# EAGLE design SMC_FrontPanel_ExtensionBoardV8_SMD (EAGLE 9.6.2)
SIZE: 0.04
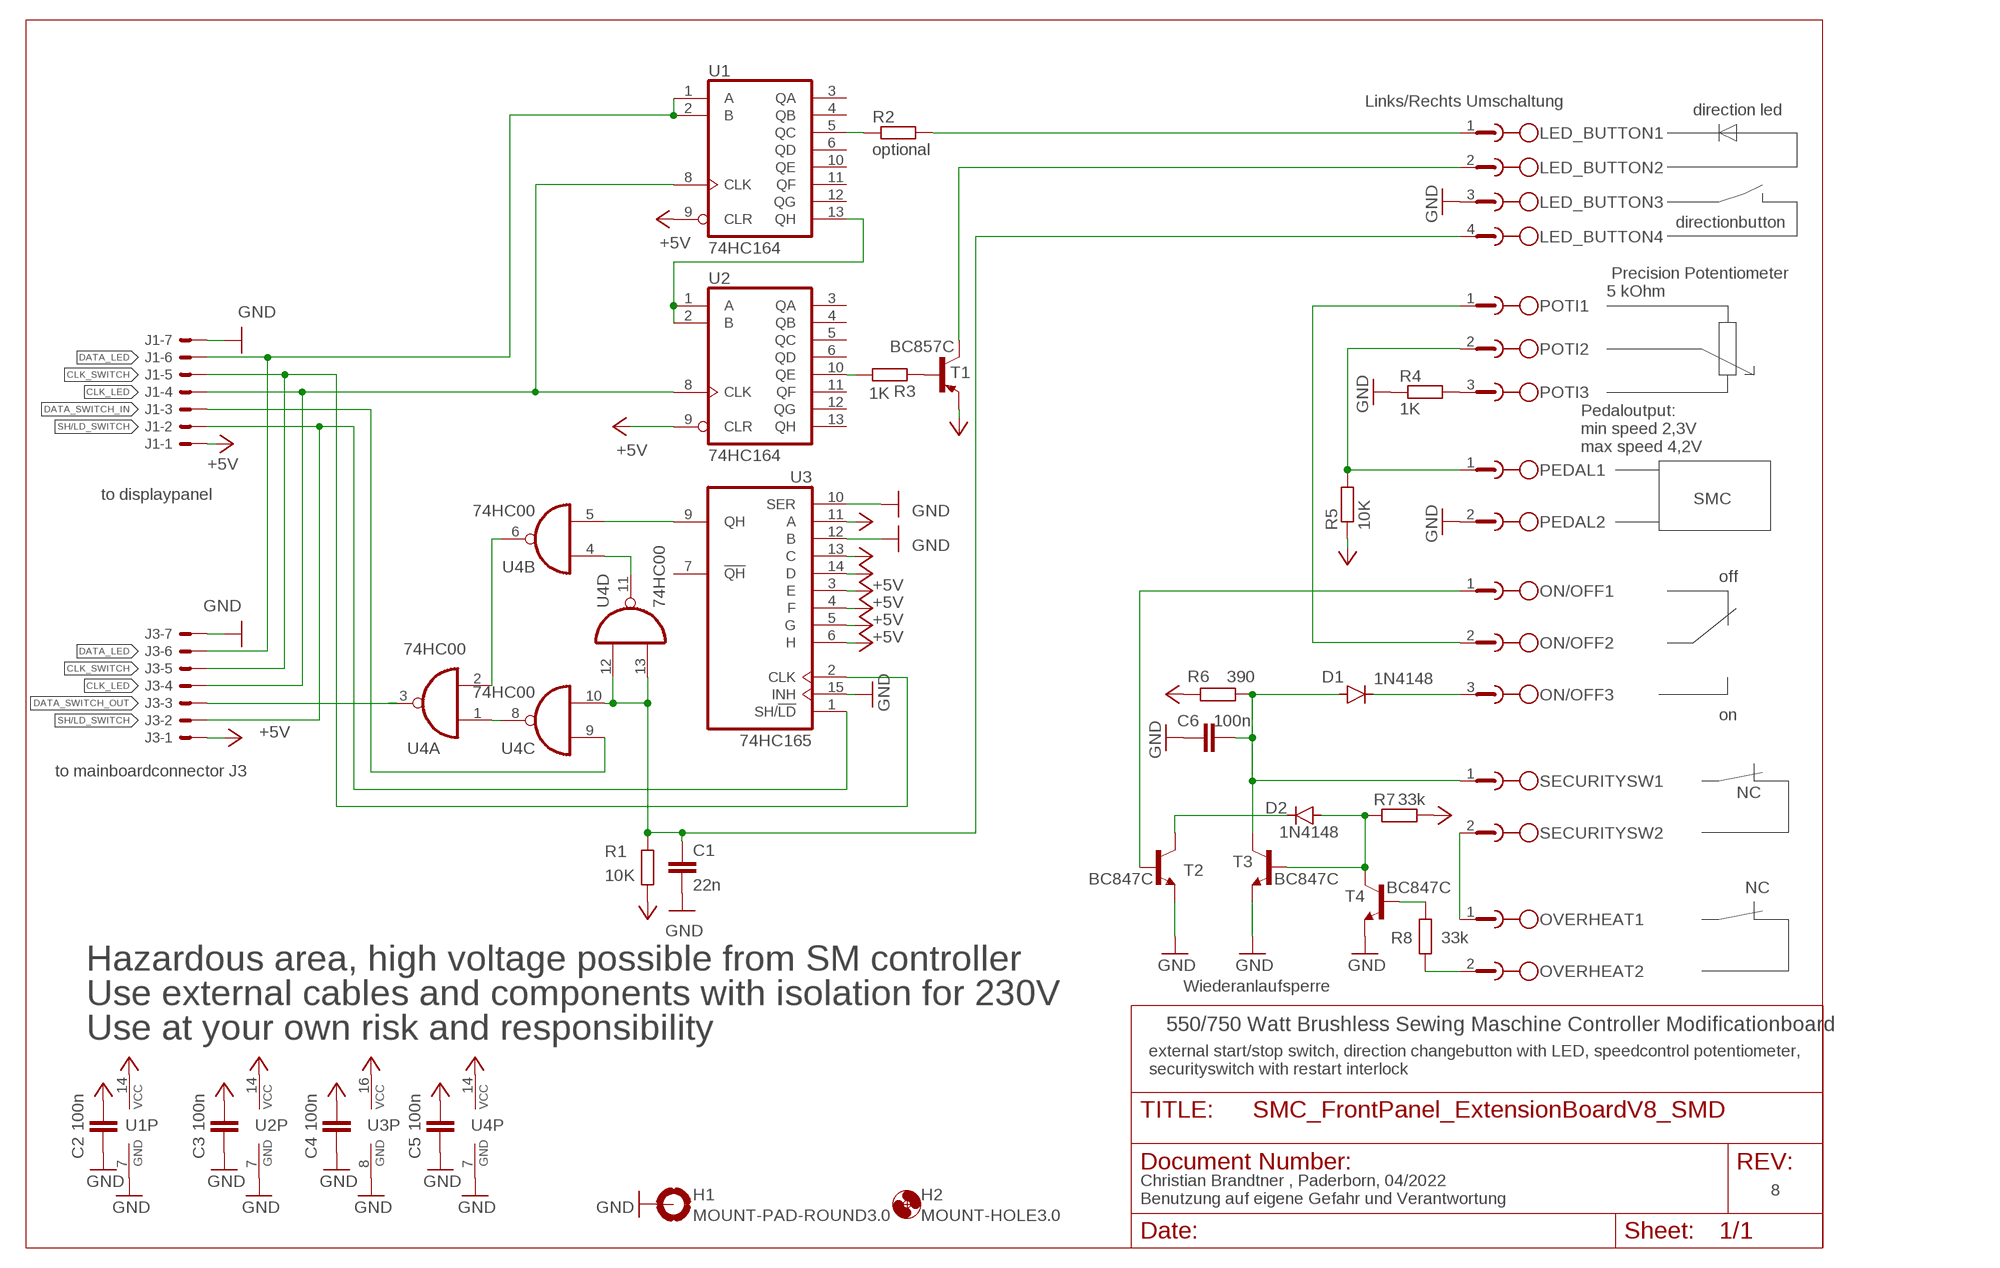
[diagram p0: schematic, sheet 1]

## Parts
C1  22n  C-EUC0805  [C0805]
C2  100n  C-EUC0805  [C0805]
C3  100n  C-EUC0805  [C0805]
C4  100n  C-EUC0805  [C0805]
C5  100n  C-EUC0805  [C0805]
C6  100n  C-EUC0805  [C0805]
D1  1N4148  DIODE-SOD323-W  [SOD323-W]
D2  1N4148  DIODE-SOD323-W  [SOD323-W]
H1  MOUNT-PAD-ROUND3.0  [3,0-PAD]
H2  MOUNT-HOLE3.0  [3,0]
J1  to displaypanel  JST-XH-07-PIN-ROUND-PAD  [JST-XH-07-PACKAGE-ROUND-PAD]
J3  to mainboardconnector J3  JST-XH-07-PIN-ROUND-PAD  [JST-XH-07-PACKAGE-ROUND-PAD]
LED_BUTTON  MC_1.5/4_G_3.5  [MC_1.5/4-G-3.5]
ON/OFF  MC_1.5/3-G-3.5  [MC_1.5/3-G-3.5]
OVERHEAT  MC_1.5/2-G-3.5  [MC_1.5/2-G-3.5]
PEDAL  MC_1.5/2-G-3.5  [MC_1.5/2-G-3.5]
POTI  MC_1.5/3-G-3.5  [MC_1.5/3-G-3.5]
R1  10K  R-EU_R0805  [R0805]
R2  optional  R-EU_R0805  [R0805]
R3  1K  R-EU_R0805  [R0805]
R4  1K  R-EU_R0805  [R0805]
R5  10K  R-EU_R0805  [R0805]
R6  390  R-EU_R0805  [R0805]
R7  33k  R-EU_R0805  [R0805]
R8  33k  R-EU_R0805  [R0805]
SECURITYSW  MC_1.5/2-G-3.5  [MC_1.5/2-G-3.5]
T1  BC857C  BC857C-PNP-SOT23-BEC  [SOT23-BEC]
T2  BC847C  BC847C-NPN-SOT23-BEC  [SOT23-BEC]
T3  BC847C  BC847C-NPN-SOT23-BEC  [SOT23-BEC]
T4  BC847C  BC847C-NPN-SOT23-BEC  [SOT23-BEC]
U1  74HC164  74HC164D  [SO14]
U2  74HC164  74HC164D  [SO14]
U3  74HC165  74HC165D  [SO16]
U4  74HC00  74HC00D  [SO14]

## Nets
+5V: C2.2 C3.2 C4.2 C5.2 J1.1 J3.1 R1.2 R5.1 R6.2 R7.1 T1.E U1.9(CLR) U1.14(VCC) U2.9(CLR) U2.14(VCC) U3.3(E) U3.4(F) U3.5(G) U3.6(H) U3.11(A) U3.13(C) U3.14(D) U3.16(VCC) U4.14(P:VCC)
CLK_LED: J1.4 J3.4 U1.8(CLK) U2.8(CLK)
CLK_SWITCH: J1.5 J3.5 U3.2(CLK)
DATA_LED: J1.6 J3.6 U1.1(A) U1.2(B)
DATA_SWITCH_IN: J1.3 U4.9(C:I0)
DATA_SWITCH_OUT: J3.3 U4.3(A:O)
G: U1.13(QH) U2.1(A) U2.2(B)
GND: C1.2 C2.1 C3.1 C4.1 C5.1 C6.1 H1.B3,0(MOUNT) J1.7 J3.7 LED_BUTTON.3 PEDAL.2 R4.1 T2.E T3.E T4.E U1.7(GND) U2.7(GND) U3.8(GND) U3.10(SER) U3.12(B) U3.15(INH) U4.7(P:GND)
N$1: R3.1 T1.B
N$2: LED_BUTTON.1 R2.2
N$3: R2.1 U1.5(QC)
N$4: LED_BUTTON.2 T1.C
N$5: ON/OFF.2 POTI.1
N$6: POTI.3 R4.2
N$7: PEDAL.1 POTI.2 R5.2
N$8: R8.1 T4.B
N$9: U3.9(QH) U4.5(B:I1)
N$10: U4.2(A:I1) U4.6(B:O)
N$11: OVERHEAT.2 R8.2
N$12: U4.1(A:I0) U4.8(C:O)
N$13: U4.4(B:I0) U4.11(D:O)
N$14: C1.1 LED_BUTTON.4 R1.1 U4.10(C:I1) U4.12(D:I0) U4.13(D:I1)
N$16: ON/OFF.1 T2.B
N$17: D1.C ON/OFF.3
N$18: C6.2 D1.A R6.1 SECURITYSW.1 T3.C
N$19: D2.C T2.C
N$20: OVERHEAT.1 SECURITYSW.2
N$23: D2.A R7.2 T3.B T4.C
N$27: R3.2 U2.10(QE)
SH/LD_SWITCH: J1.2 J3.2 U3.1(SH/!LD)
Unconnected: U1.3(QA) U1.4(QB) U1.6(QD) U1.10(QE) U1.11(QF) U1.12(QG) U2.3(QA) U2.4(QB) U2.5(QC) U2.6(QD) U2.11(QF) U2.12(QG) U2.13(QH) U3.7(!QH)

## Notes on the sheet
- Links/Rechts Umschaltung
- direction led
- directionbutton
- Precision Potentiometer
  5 kOhm
- Pedaloutput:
  min speed 2,3V
  max speed 4,2V
- SMC
- off
- on
- NC
- NC
- Hazardous area, high voltage possible from SM controller
- Wiederanlaufsperre
- Use external cables and components with isolation for 230V
- 550/750 Watt Brushless Sewing Maschine Controller Modificationboard
- Use at your own risk and responsibility
- external start/stop switch, direction changebutton with LED, speedcontrol potentiometer,
  securityswitch with restart interlock
- 8
- Christian Brandtner , Paderborn, 04/2022
  Benutzung auf eigene Gefahr und Verantwortung

## Library data of the parts
C1-C6 = rcl:C-EU: CAPACITOR, European symbol; SPICEPREFIX: C
D1 D2 = diode:DIODE-: DIODE
H1 = holes:MOUNT-PAD-ROUND: MOUNTING PAD, round
H2 = holes:MOUNT-HOLE: MOUNTING HOLE with drill center marker
J1 J3 = Rembrandt Electronics - JST XH Connectors v1-0:JST-XH-07-PIN: JST XH Connector 2 Pin Wire to board connector. Pitch: 2,54 mm, (0.100") Number of pins: 7 Created by Rembrandt Electronics www.rembrandtelectronics.com
LED_BUTTON = con-phoenix-350_CB:MC_1.5/4_G_3.5
ON/OFF POTI = con-phoenix-350_CB:MC_1.5/3-G-3.5
OVERHEAT PEDAL SECURITYSW = con-phoenix-350_CB:MC_1.5/2-G-3.5
R1-R8 = resistor:R-EU_: RESISTOR, European symbol
T1 = transistor:*-PNP-: PNP Transistror
T2-T4 = transistor:*-NPN-: NPN Transistror BF959 corrected 2008.03.06
U1 U2 = 74xx-eu:74*164: 8-bit parallel out SHIFT REGISTER
U3 = 74xx-eu:74*165: 8-bit parallel load SHIFT REGISTER
U4 = 74xx-eu:74*00: Quad 2-input NAND gate

## Board
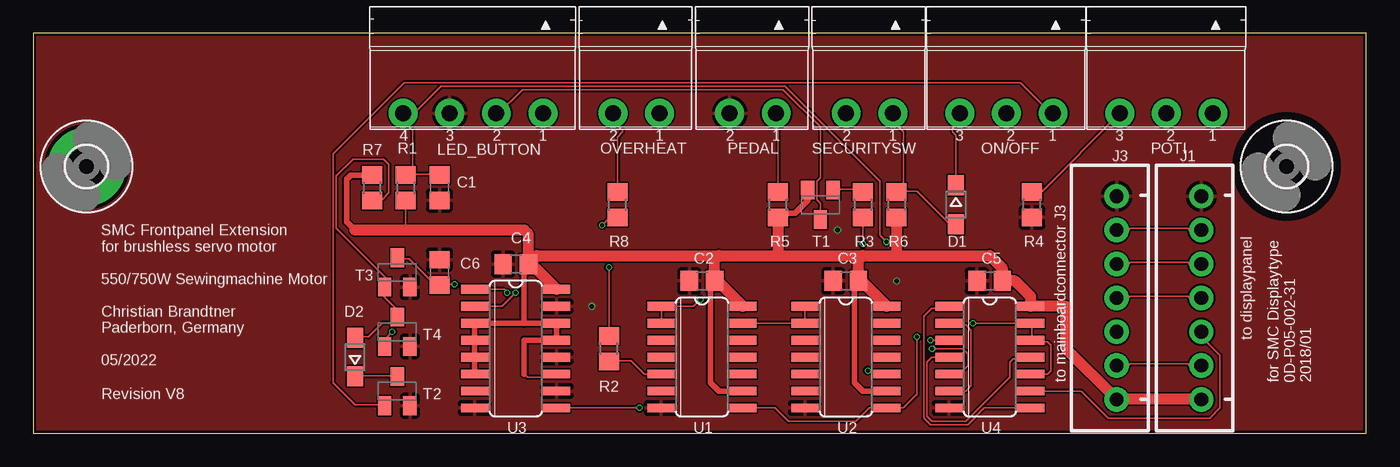
[diagram p1: board, top side]
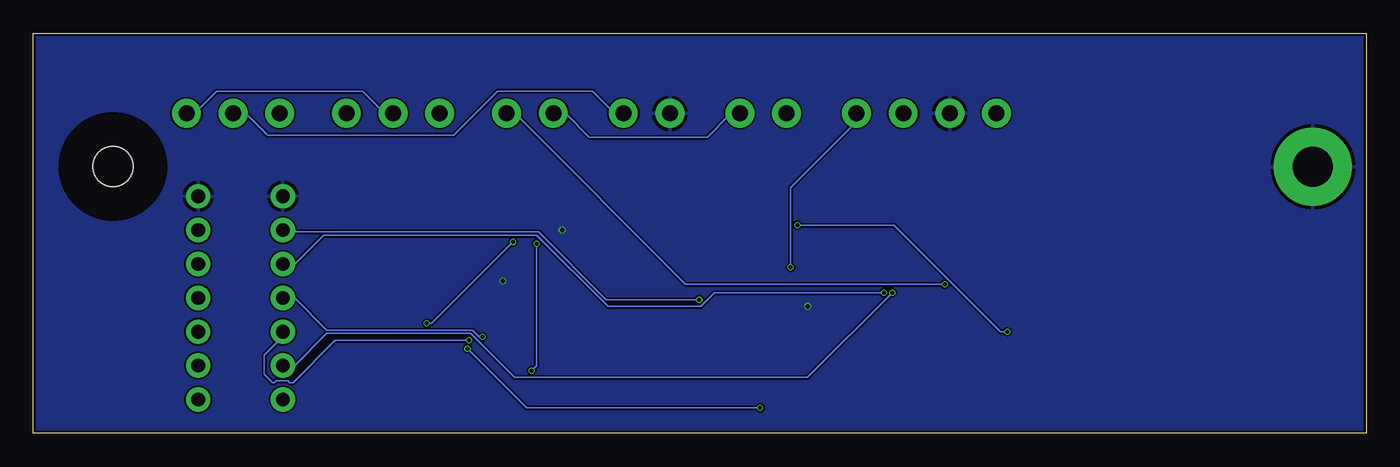
[diagram p2: board, bottom side, seen from below]

Size 100 x 30 mm. Coordinates in mm from the lower left corner, seen from the top.
Outline: 0,0 100,0 100,30 0,30 0,0
Copper layers (1*16): Top 0.035mm / dielectric 1.6mm / Bottom 0.035mm
Design rules "jlcpcb-2layers": minimum track width 5mil, minimum drill 0.3mm, track to track 5mil, track to pad 5mil, pad to pad 5mil, via to via 5mil, smd to smd 5mil, copper to edge 0.2mm, drill to drill 6mil, minimum pad ring 10mil, minimum via ring 3mil, stop-mask expansion 4mil, vias tented up to drill 0mil, thermal gap 10mil

### Footprints (pad centres in the part's own frame; a part is rotated, then mirrored left to right if it is on the bottom)
C0805 = smd 1.3 x 1.5: 1 -0.95,0; 2 0.95,0
SOD323-W = smd 1.5 x 1.2: A 1.45,0; C -1.45,0
3,0-PAD = drill 3 pad 5.842: B3,0 0,0
3,0 = hole 3: 0,0
JST-XH-07-PACKAGE-ROUND-PAD = drill 1.016: 1 -7.62,0; 2 -5.08,0; 3 -2.54,0; 4 0,0; 5 2.54,0; 6 5.08,0; 7 7.62,0
MC_1.5/4-G-3.5 = drill 1.2 pad 2: 1 0.013,0; 2 3.513,0; 3 7.013,0; 4 10.513,0
MC_1.5/3-G-3.5 = drill 1.2 pad 2: 1 -3.511,0; 2 -0.011,0; 3 3.489,0
MC_1.5/2-G-3.5 = drill 1.2 pad 2: 1 0.013,0; 2 3.513,0
R0805 = smd 1.3 x 1.5: 1 -0.95,0; 2 0.95,0
SOT23-BEC = smd 1 x 1.4: B -0.95,-1.1; C 0,1.1; E 0.95,-1.1
SO14 = smd 0.66 x 2.032: 1 -3.81,-3.073; 2 -2.54,-3.073; 3 -1.27,-3.073; 4 0,-3.073; 5 1.27,-3.073; 6 2.54,-3.073; 7 3.81,-3.073; 8 3.81,3.073; 9 2.54,3.073; 10 1.27,3.073; 11 0,3.073; 12 -1.27,3.073; 13 -2.54,3.073; 14 -3.81,3.073
SO16 = smd 0.66 x 2.032: 1 -4.445,-3.073; 2 -3.175,-3.073; 3 -1.905,-3.073; 4 -0.635,-3.073; 5 0.635,-3.073; 6 1.905,-3.073; 7 3.175,-3.073; 8 4.445,-3.073; 9 4.445,3.073; 10 3.175,3.073; 11 1.905,3.073; 12 0.635,3.073; 13 -0.635,3.073; 14 -1.905,3.073; 15 -3.175,3.073; 16 -4.445,3.073

### Placement (x,y rotation side)
C1  30.48,18.41 270 top
C2  50.16,11.43 0 top
C3  60.96,11.43 0 top
C4  36.2,12.7 0 top
C5  71.75,11.43 0 top
C6  30.48,12.06 270 top
D1  69.22,17.14 270 top
D2  24.13,5.71 90 top
H1  4,20 0 top
H2  94.03,20.01 0 top
J1  87.63,10.16 90 top
J3  81.28,10.16 90 top
LED_BUTTON  38.25,24 180 top
ON/OFF  73,24 180 top
OVERHEAT  47,24 180 top
PEDAL  55.75,24 180 top
POTI  85,24 180 top
R1  27.94,18.41 270 top
R2  43.18,6.35 90 top
R3  62.23,17.14 270 top
R4  74.93,17.14 90 top
R5  55.88,17.14 90 top
R6  64.77,17.14 270 top
R7  25.4,18.41 270 top
R8  43.81,17.14 90 top
SECURITYSW  64.5,24 180 top
T1  59.05,17.14 180 top
T2  27.3,3.17 0 top
T3  27.3,12.06 0 top
T4  27.3,7.62 0 top
U1  50.16,5.71 270 top
U2  60.96,5.71 270 top
U3  36.2,6.35 270 top
U4  71.75,5.71 270 top

### Tracks (layer width: path | path; a pad name or v marks a point on that pad's centre or on a via)
+5V
  Top 0.127: 27.94,15.24 R1.2 | 36.83,4.45 37.08,4.19 38.99,4.19 39.24,4.45 U3.11
  Top 0.406: 24.13,15.24 23.5,15.88 23.5,19.05 23.81,19.36 R7.1 | U3.6 U3.5 U3.4 U3.3 36.83,8.26 | 36.83,4.45 36.83,6.99 U3.13 U3.14 36.83,8.26 | 36.83,8.26 36.83,12.38 C4.2 | R5.1 56.2,16.51 57.15,16.51 58.1,17.46 T1.E | U2.9 62.23,3.17 61.59,3.81 61.59,11.12 C3.2 | U1.9 51.44,3.17 50.8,3.81 50.8,11.12 C2.2
  Top 0.813: J1.1 J3.1 77.47,6.35 77.47,9.53 U4.14 74.83,10.26 73.66,11.43 C5.2 72.7,12.38 71.75,13.34 64.77,13.34 | 51.44,13.34 51.12,13.02 C2.2 51.33,11.43 U1.14 | 51.44,13.34 55.88,13.34 | 55.88,13.34 62.23,13.34 | 62.23,13.34 64.77,13.34 | R6.2 64.77,13.34 | R5.1 55.88,13.34 | C4.2 37.78,13.34 51.44,13.34 | U3.16 37.36,12.7 C4.2 | U2.14 62.13,11.43 C3.2 61.91,13.02 62.23,13.34 | C4.2 37.15,14.93 36.83,15.24 27.94,15.24 24.13,15.24
CLK_LED  (via drill 0.3)
  Top 0.127: U1.8 55.63,1.91 56.64,0.89 61.72,0.89 62.74,1.91 U2.8 65.28,1.91 66.29,2.92 v66.29,7.24 | J3.4 82.17,10.16 82.3,10.29 86.61,10.29 86.74,10.16 J1.4
  Bottom 0.127: v66.29,7.24 66.55,7.24 67.06,7.75 77.98,7.75 80.39,10.16 J3.4
CLK_SWITCH  (via drill 0.3)
  Top 0.127: U3.2 35.18,9.53 v36.2,10.54 | J1.5 86.74,12.7 86.61,12.83 82.3,12.83 82.17,12.7 J3.5
  Bottom 0.127: v36.2,10.54 48.9,10.54 49.91,9.53 56.9,9.53 62.23,14.86 78.23,14.86 80.39,12.7 J3.5
DATA_LED  (via drill 0.3)
  Top 0.127: 47.12,9.53 47.12,8.26 U1.2 | 47.12,9.53 49.53,9.53 v50.04,10.03 | 47.12,9.53 U1.1 | J1.6 86.74,15.24 86.61,15.37 82.3,15.37 82.17,15.24 J3.6
  Bottom 0.127: v50.04,10.03 57.02,10.03 62.1,15.11 80.26,15.11 80.39,15.24 J3.6
DATA_SWITCH_IN
  Top 0.127: U4.9 78.61,3.17 80.64,1.14 88.27,1.14 89.03,1.91 89.03,5.84 87.63,7.24 J1.3
DATA_SWITCH_OUT  (via drill 0.3)
  Top 0.127: v67.31,6.99 U4.3
  Bottom 0.127: v67.31,6.99 77.34,6.99 80.52,3.81 80.77,3.81 80.9,3.94 81.79,3.94 81.92,3.81 82.04,3.81 82.68,4.45 82.68,5.84 81.28,7.24 J3.3
G
  Top 0.127: U1.13 U2.2 57.91,8.26 57.91,9.53 U2.1
GND  (via drill 0.35)
  other vias: 41.91,9.53 60.33,15.24 64.77,11.43
  pour Top: 0,29.84 0,0 99.69,0 99.69,29.84
  pour Bottom: 0,29.84 0,0 99.69,0 99.69,29.84
N$1
  Top 0.127: T1.B 60.07,18.29 62.1,18.29 62.23,18.16 R3.1
N$2  (via drill 0.3)
  Top 0.127: v43.18,12.45 R2.2
  Bottom 0.127: v43.18,12.45 43.18,18.41 38.35,23.24 38.35,23.88 LED_BUTTON.1
N$3
  Top 0.127: U1.5 45.85,4.45 44.83,5.46 43.18,5.46 R2.1
N$4
  Top 0.127: T1.C 59.05,17.27 58.8,17.53 58.8,18.92 59.05,19.18 59.05,22.99 56.26,25.78 36.7,25.78 34.8,23.88 LED_BUTTON.2
N$5
  Bottom 0.127: ON/OFF.2 73.03,24 73.66,24 75.31,25.65 86.23,25.65 87.88,24 88.39,24 POTI.1
N$6
  Top 0.127: R4.2 74.93,18.16 75.69,18.16 81.41,23.88 POTI.3
N$7
  Top 0.127: R5.2 55.88,22.73 55.75,22.86 55.75,23.88 PEDAL.1
  Bottom 0.127: POTI.2 84.96,23.88 83.95,23.88 82.42,22.35 68.45,22.35 65.15,25.65 58.04,25.65 56.39,24 55.75,24 PEDAL.1
N$8  (via drill 0.3)
  Top 0.127: v26.92,7.62 26.42,7.11 26.42,6.6 T4.B | v42.67,15.62 43.18,16.13 43.81,16.13 R8.1
  Bottom 0.127: v26.92,7.62 27.43,7.62 35.43,15.62 v42.67,15.62
N$9  (via drill 0.3)
  Top 0.127: v45.47,1.91 U3.9 | v67.44,6.35 67.56,6.48 67.69,6.35 69.72,6.35 70.1,5.97 70.1,5.08 69.47,4.45 U4.5
  Bottom 0.127: v45.47,1.91 62.99,1.91 v67.44,6.35
N$10
  Top 0.127: U4.6 69.98,3.17 70.36,3.56 70.36,7.75 69.98,8.13 68.83,8.13 68.71,8.26 U4.2
N$11
  Top 0.127: R8.2 43.81,22.23 44.2,22.61 44.2,22.73 43.56,23.37 43.56,23.88 OVERHEAT.2
N$12
  Top 0.127: U4.8 71.37,1.91 70.1,0.64 67.31,0.64 66.8,1.14 66.8,8.76 67.44,9.4 68.45,9.4 68.58,9.53 U4.1
N$13
  Top 0.127: U4.4 67.44,5.71 67.06,5.33 67.06,1.27 67.44,0.89 69.98,0.89 73.28,4.19 73.28,5.33 73.53,5.59 74.68,5.59 74.8,5.71 U4.11
N$14  (via drill 0.3)
  Top 0.127: U4.10 76.07,4.45 76.33,4.7 76.33,6.6 76.07,6.86 75.06,6.86 74.93,6.99 | 74.93,6.99 74.93,8.26 U4.13 v70.48,8.26 | 74.93,6.99 U4.12 | 28.45,19.43 30.48,19.43 C1.1 | 28.45,19.43 27.94,19.43 R1.1 28.45,19.43 | 28.45,19.43 28.45,22.73 27.81,23.37 27.81,23.88 LED_BUTTON.4 27.81,24 28.57,24 30.61,26.04 56.39,26.04 63.5,18.92 63.5,14.86 v64.01,14.35
  Bottom 0.127: v70.48,8.26 70.1,8.26 v64.01,14.35
N$16
  Top 0.127: T2.B 26.29,2.16 24.13,2.16 22.48,3.81 22.48,20.95 27.81,26.29 74.04,26.29 76.45,23.88 ON/OFF.1
N$17
  Top 0.127: D1.C 69.22,22.35 68.96,22.61 68.96,22.86 69.47,23.37 69.47,23.88 ON/OFF.3
N$18  (via drill 0.3)
  Top 0.127: 65.28,18.16 66.29,18.16 68.71,15.75 69.22,15.75 D1.A | 65.28,18.16 64.77,18.16 R6.1 65.28,18.16 | 30.48,11.18 30.1,11.18 28.19,13.08 27.3,13.08 T3.C | v31.62,11.18 30.48,11.18 | 30.48,11.18 C6.2 | 65.28,18.16 65.28,22.61 64.52,23.37 64.52,23.88 SECURITYSW.1
  Bottom 0.127: v31.62,11.18 51.05,11.18 63.75,23.88 64.39,23.88 SECURITYSW.1
N$19
  Top 0.127: T2.C 27.3,4.32 24.13,4.32 D2.C
N$20
  Bottom 0.127: OVERHEAT.1 46.99,23.88 47.75,23.88 49.4,22.23 58.29,22.23 59.94,23.88 60.96,23.88 SECURITYSW.2
N$23
  Top 0.127: D2.A 24.13,7.24 25.15,7.24 26.16,8.26 26.92,8.26 27.3,8.64 T4.C 27.3,9.27 26.29,10.29 26.29,10.92 T3.B 26.42,11.05 26.42,11.68 22.73,15.37 22.73,19.3 24,20.57 26.29,20.57 26.67,20.19 26.67,18.03 26.16,17.53 25.4,17.53 R7.2
N$27  (via drill 0.3)
  Top 0.127: v62.23,14.22 R3.2 | v62.61,4.7 62.74,4.57 63.88,4.57 64.01,4.45 U2.10
  Bottom 0.127: v62.23,14.22 62.23,5.08 v62.61,4.7
SH/LD_SWITCH  (via drill 0.3)
  Top 0.127: U3.1 35.31,10.79 v35.56,10.54 | J1.2 86.74,5.08 86.61,5.21 82.3,5.21 82.17,5.08 J3.2
  Bottom 0.127: v35.56,10.54 41.91,4.19 63.88,4.19 67.18,7.49 77.98,7.49 80.39,5.08 J3.2

### Text on the board
tNames: SMC Frontpanel Extension / for brushless servo motor / / 550/750W Sewingmachine Motor / / Christian Brandtner / Paderborn, Germany / / 05/2022 | for SMC Displaytype / 0D-P05-002-31 / 2018/01 | Revision V8